# EAGLE design 5V 7805 (EAGLE 7.3.0)
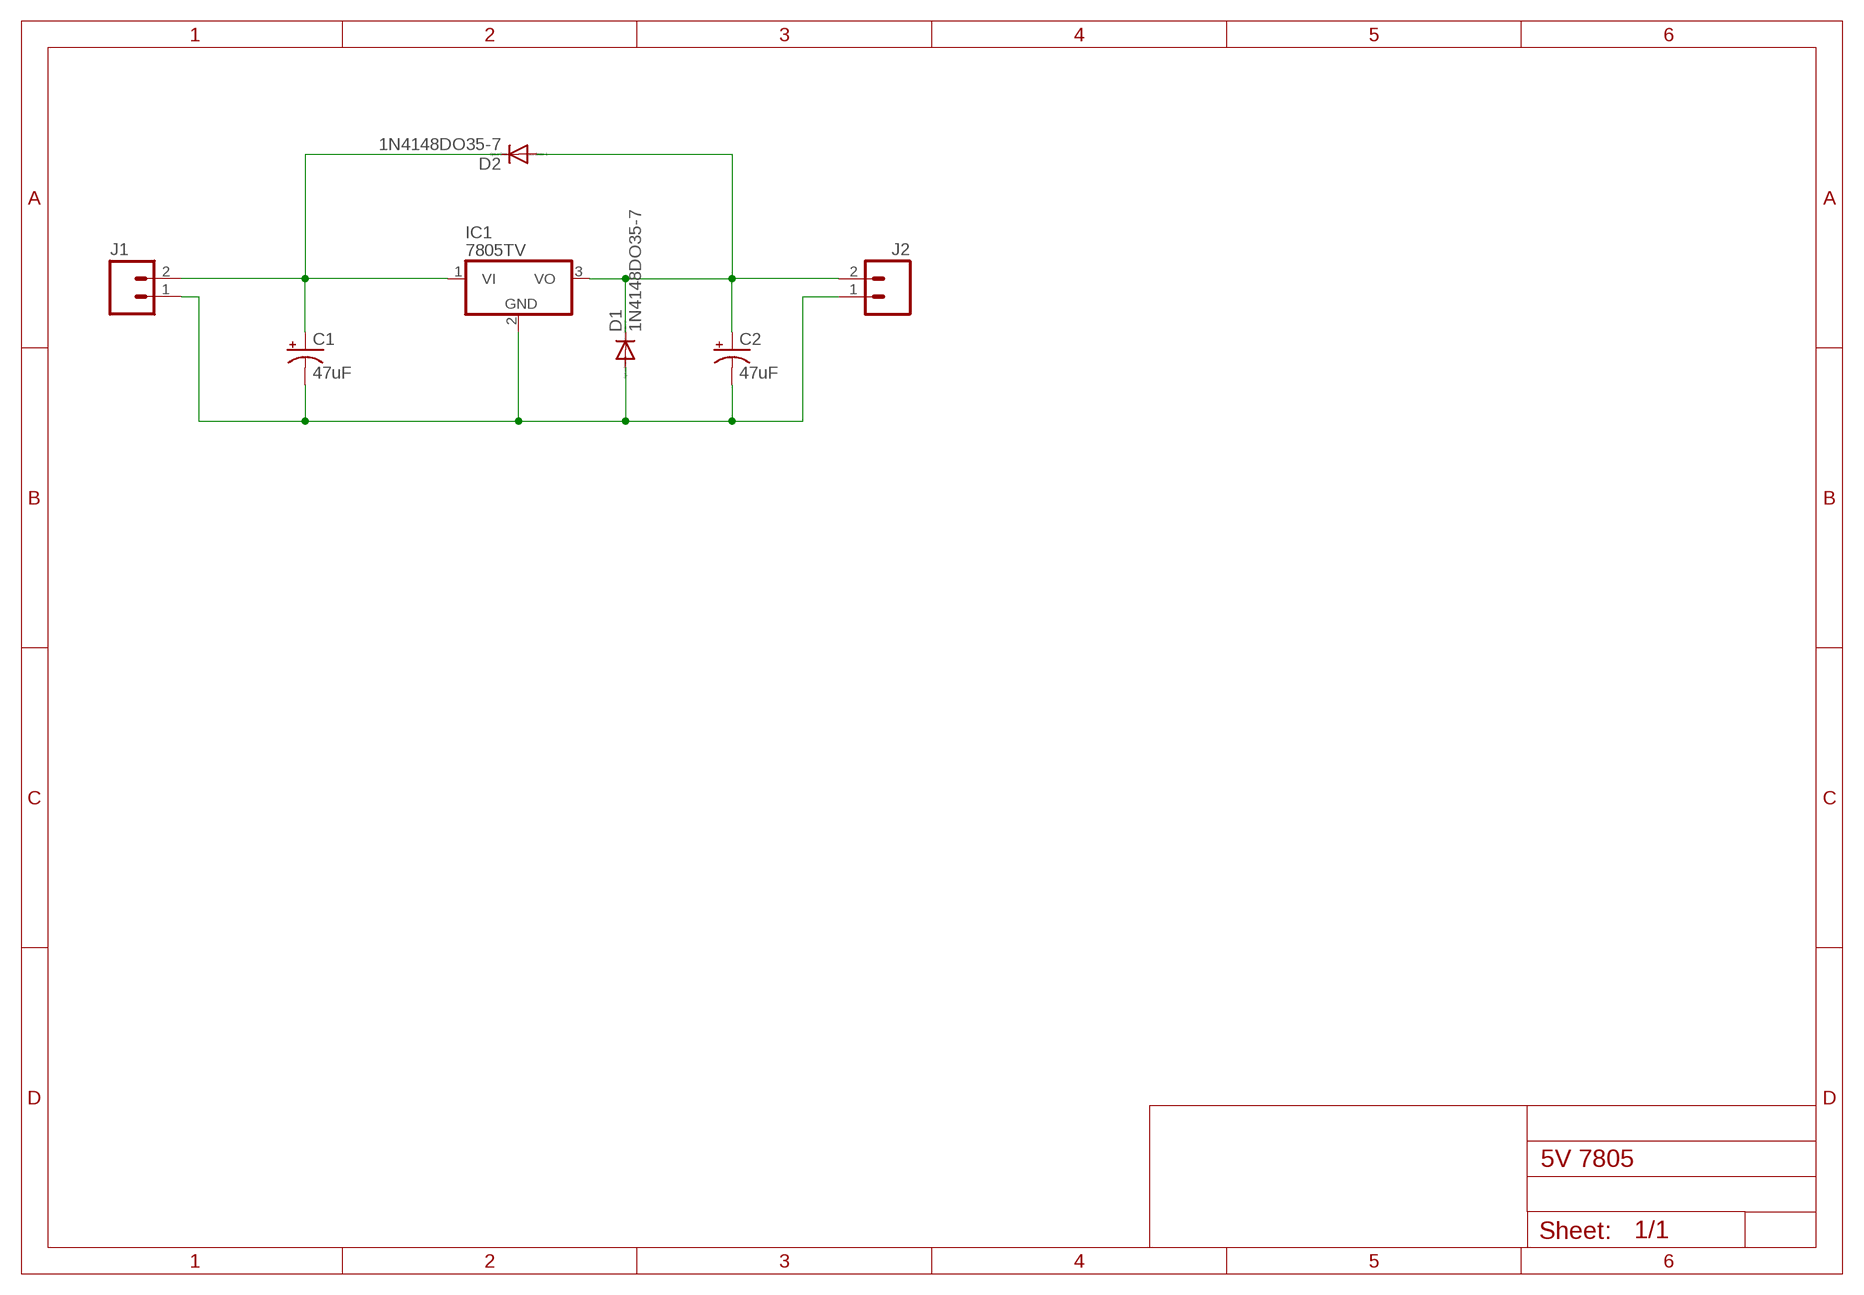
[diagram p0: schematic, sheet 1]

## Parts
C1  47uF  100UF-25V-20%(PTH)  [CPOL-RADIAL-100UF-25V]
C2  47uF  100UF-25V-20%(PTH)  [CPOL-RADIAL-100UF-25V]
D1  1N4148DO35-7  [DO35-7]
D2  1N4148DO35-7  [DO35-7]
IC1  7805TV  [TO220V]
J1  M025MM  [SCREWTERMINAL-5MM-2]
J2  M025MM  [SCREWTERMINAL-5MM-2]

## Nets
5V: C2.1(+) D1.C D2.A IC1.3(VO) J2.2
12V: C1.1(+) D2.C IC1.1(VI) J1.2
GND: C1.2(-) C2.2(-) D1.A IC1.2(GND) J1.1 J2.1

## Library data of the parts
C1 C2 = SparkFun-Capacitors:100UF-25V-20%(PTH): CAP-08439; PROD_ID: CAP-08439
D1 D2 = diode:1N4148: DIODE high speed (Philips)
IC1 = linear:78*: Positive VOLTAGE REGULATOR Source: http://cache.national.com/ds/LM/LM78L05.pdf http://www.fairchildsemi.com/ds/LM/LM7805.pdf
J1 J2 = SparkFun-Connectors:M02: Standard 2-pin 0.1" header. Use with - straight break away headers ( PRT-00116) - right angle break away headers (PRT-00553) - swiss pins (PRT-00743) - machine pins (PRT-00117) - female headers (PRT-00115) Molex polarized connector foot print use with: PRT-08233 with associated crimp pins and housings. 2.54_SCREWTERM for use with PRT-10571. 3.5mm Screw Terminal footprints for PRT-08084 5mm Screw Terminal footprints for use with PRT-08432; STOREFRONT_ID: PRT-08432

## Board
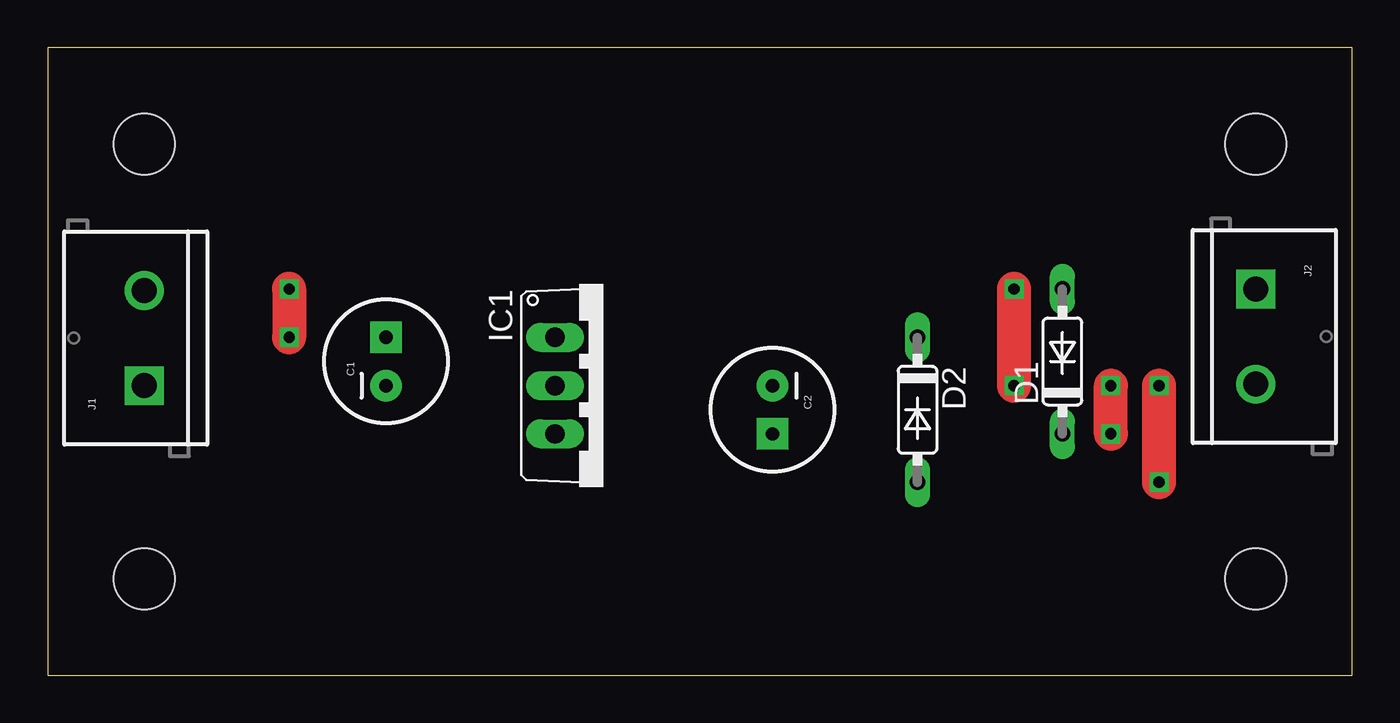
[diagram p1: board, top side]
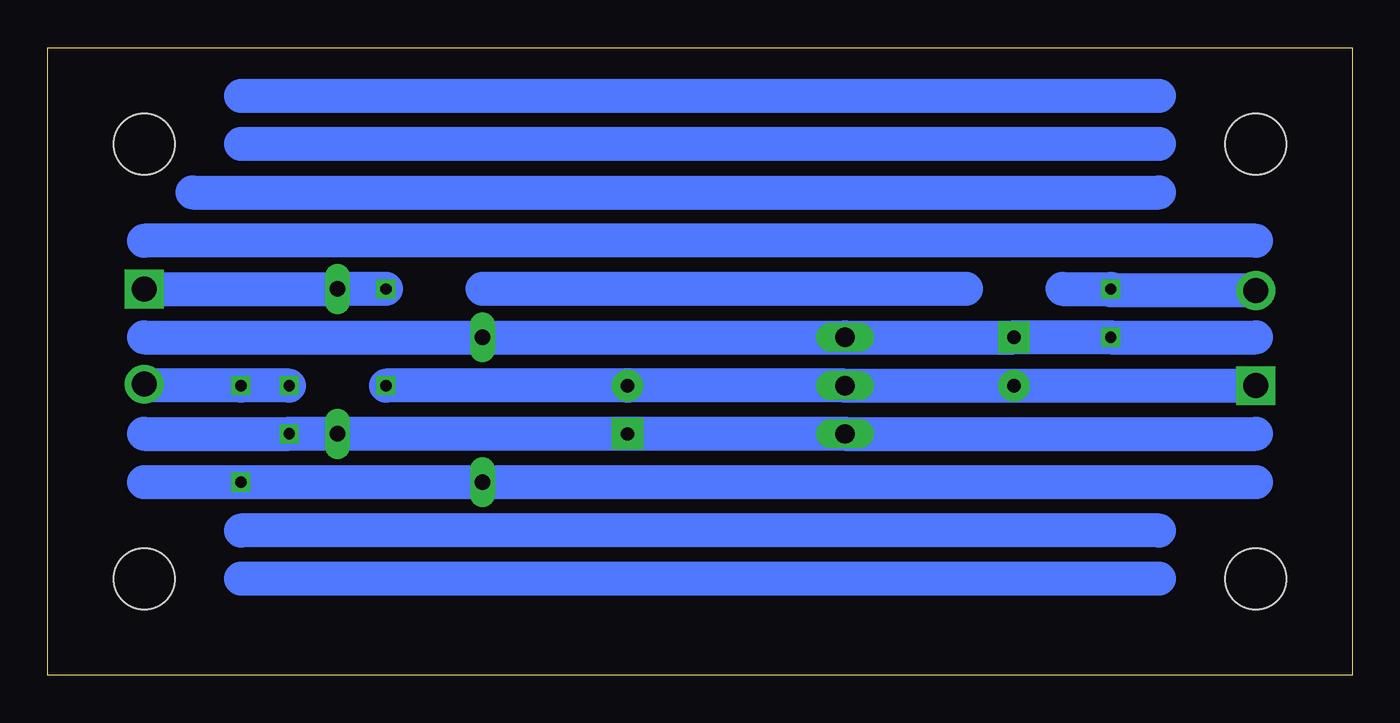
[diagram p2: board, bottom side, seen from below]

Size 68.58 x 33.02 mm. Coordinates in mm from the lower left corner, seen from the top.
Outline: 0,0 68.58,0 68.58,33.02 0,33.02 0,0
Copper layers (1*16): Top 0.035mm / dielectric 1.5mm / Bottom 0.035mm
Design rules "default": minimum track width 10mil, minimum drill 24mil, track to track 8mil, track to pad 8mil, pad to pad 8mil, via to via 8mil, smd to smd 8mil, copper to edge 40mil, drill to drill 8mil, minimum pad ring 10mil, minimum via ring 8mil, stop-mask expansion 4mil, vias tented up to drill 0mil, thermal gap 10mil
Holes 3.2 mm at 5.08,5.08 5.08,27.94 63.5,27.94 63.5,5.08

### Footprints (pad centres in the part's own frame; a part is rotated, then mirrored left to right if it is on the bottom)
CPOL-RADIAL-100UF-25V = drill 0.7 pad 1.651 square: 1 1.27,0 | drill 0.7 pad 1.651: 2 -1.27,0
DO35-7 = drill 0.813 long: A 3.81,0; C -3.81,0
TO220V = drill 1.016 long: 1 -2.54,-2.54; 2 0,-2.54; 3 2.54,-2.54
SCREWTERMINAL-5MM-2 = drill 1.3 pad 2.032 square: 1 0,0 | drill 1.3 pad 2.032: 2 5,0

### Placement (x,y rotation side)
C1  17.78,16.51 90 top
C2  38.1,13.97 270 top
D1  53.34,16.51 90 top
D2  45.72,13.97 270 top
IC1  29.21,15.24 270 top
J1  5.08,15.24 90 top
J2  63.5,20.32 270 top

### Tracks (layer width: path | path; a pad name or v marks a point on that pad's centre or on a via)
5V  (via drill 0.6)
  Top 1.778: v55.88,12.7 v55.88,15.24 | v58.42,10.16 v58.42,15.24
  Bottom 1.778: v55.88,15.24 v58.42,15.24 63.5,15.24 J2.2 | D2.A v58.42,10.16 | 5.08,12.7 IC1.3 C2.1 D1.C v55.88,12.7 63.5,12.7
12V  (via drill 0.6)
  Top 1.778: v12.7,20.32 v12.7,17.78
  Bottom 1.778: J1.2 12.7,20.24 v12.7,20.32 15.24,20.32 | 5.08,17.78 v12.7,17.78 C1.1 IC1.1 D2.C 63.5,17.78
GND  (via drill 0.6)
  Top 1.778: v50.8,15.24 v50.8,20.32
  Bottom 1.778: J1.1 C1.2 IC1.2 C2.2 v50.8,15.24 | v50.8,20.32 D1.A J2.1
N$1
  Bottom 1.778: 5.08,10.16 63.5,10.16
N$2
  Bottom 1.778: 10.16,7.62 58.42,7.62
N$3
  Bottom 1.778: 5.08,22.86 63.5,22.86
N$4
  Bottom 1.778: 60.96,25.4 10.16,25.4
N$5
  Bottom 1.778: 10.16,27.94 58.42,27.94
N$6
  Bottom 1.778: 10.16,5.08 58.42,5.08
N$7
  Bottom 1.778: 58.42,30.48 10.16,30.48
N$8
  Bottom 1.778: 20.32,20.32 45.72,20.32